# Altium schematic sheet EE194_YESDIG_PCB.SchDoc
size A2
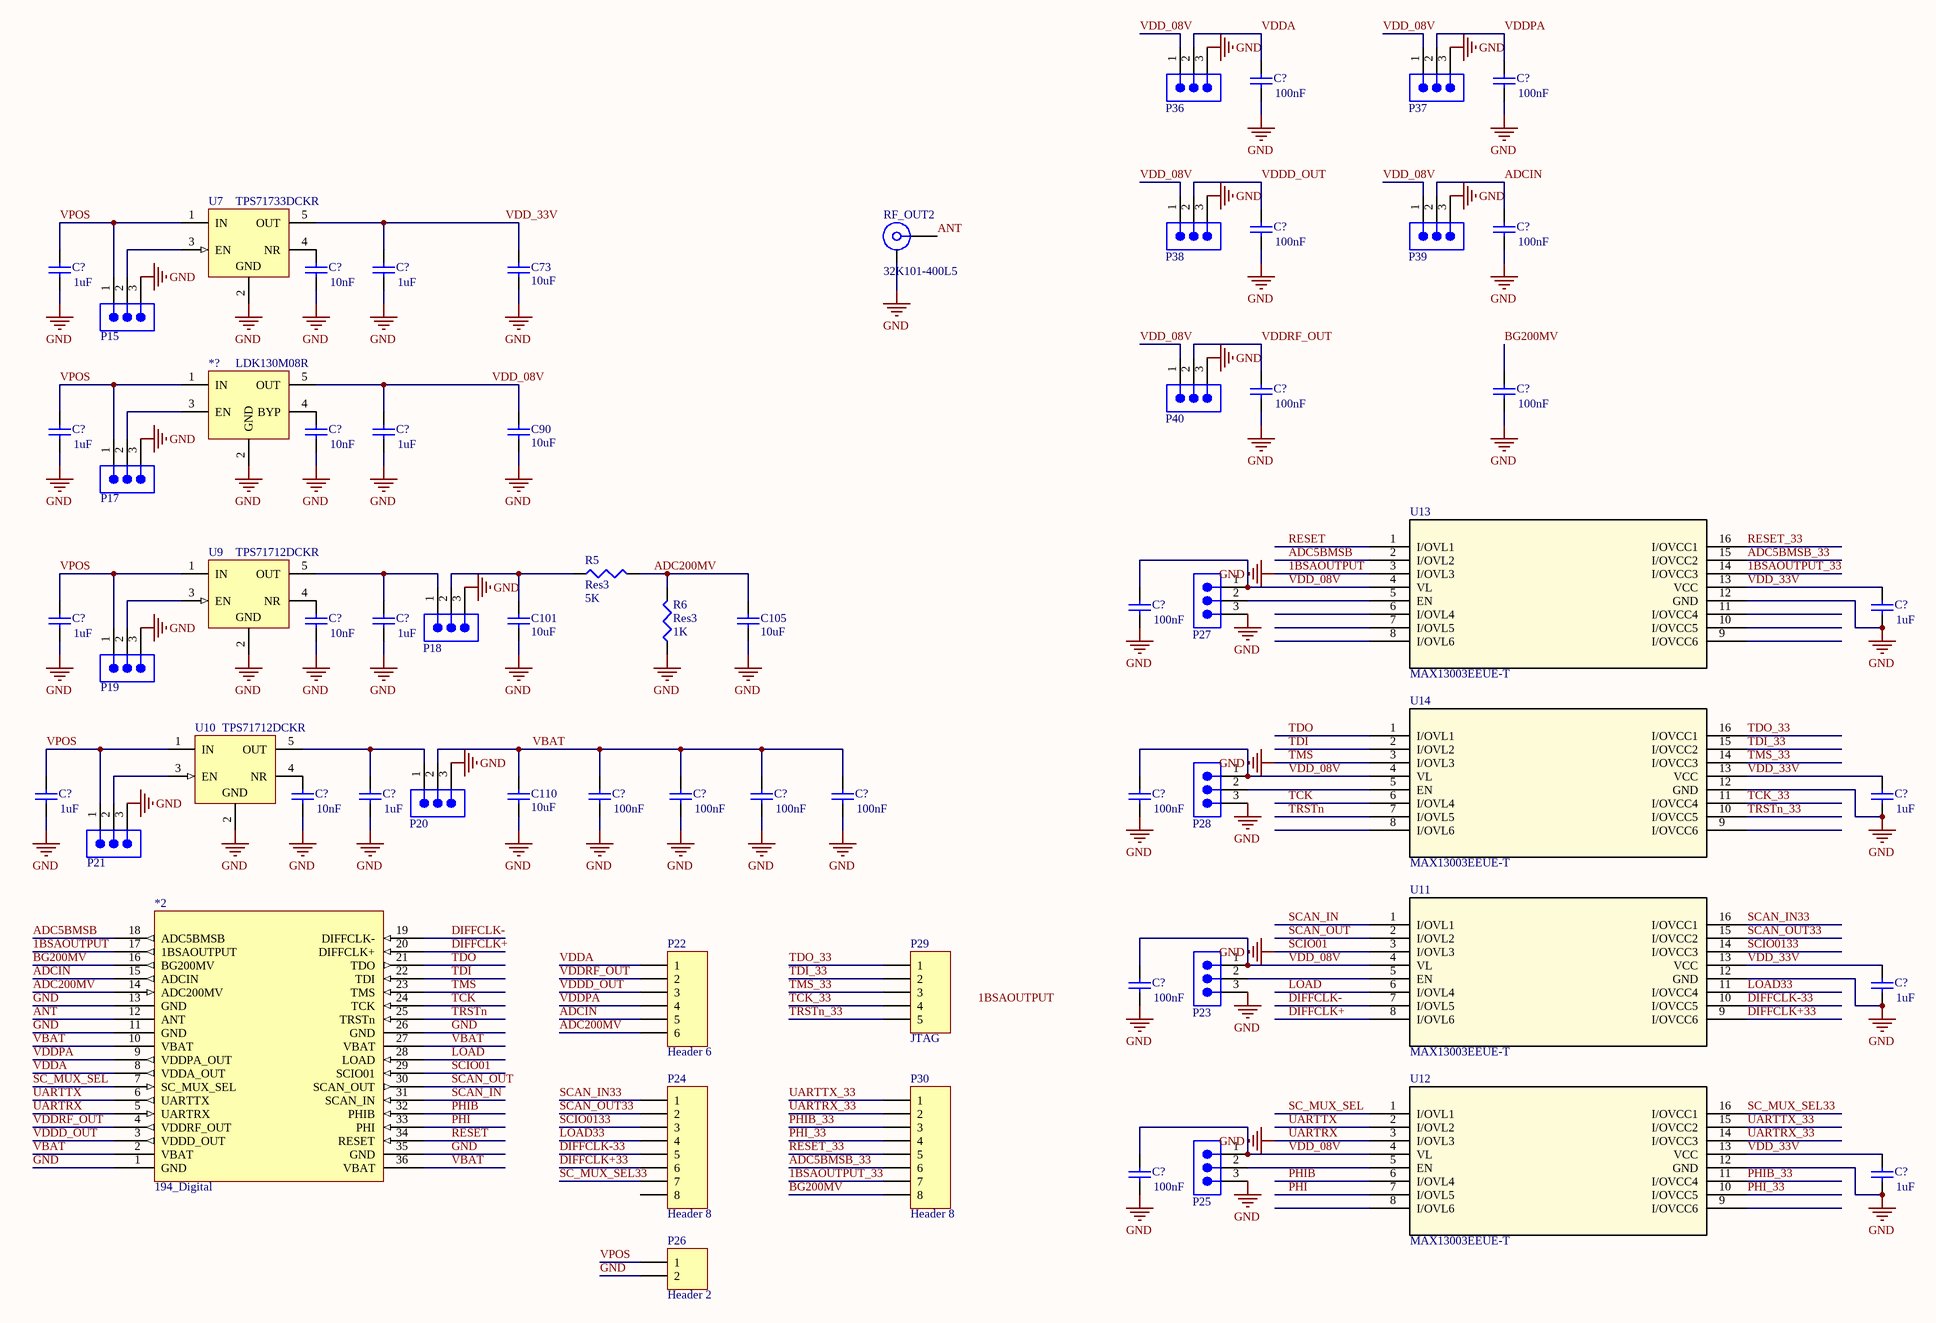
[diagram p0: EE194_YESDIG_PCB.SchDoc]

## Parts
(Parts that share a designator on the sheet are numbered #1, #2 ... from top to bottom, then left to right.)
*2  194_Digital  [EE194_Analog_Chip]
*?  LDK130M08R  [SOT95P290X145-5N]
C73  value 10uF  [CAPC0805(2012)145_N]  (hidden comment: CAP 10uF 25V 0805(2012))
C90  value 10uF  [CAPC0805(2012)145_N]  (hidden comment: CAP 10uF 25V 0805(2012))
C101  value 10uF  [CAPC0805(2012)145_N]  (hidden comment: CAP 10uF 25V 0805(2012))
C105  value 10uF  [CAPC0805(2012)145_N]  (hidden comment: CAP 10uF 25V 0805(2012))
C110  value 10uF  [CAPC0805(2012)145_N]  (hidden comment: CAP 10uF 25V 0805(2012))
C?#1  value 100nF  [0402]  (hidden comment: Cap Semi)
C?#2  value 100nF  [0402]  (hidden comment: Cap Semi)
C?#3  value 100nF  [0402]  (hidden comment: Cap Semi)
C?#4  value 100nF  [0402]  (hidden comment: Cap Semi)
C?#5  value 1uF  [6-0805_N]  (hidden comment: Cap Semi)
C?#6  value 10nF  [6-0805_N]  (hidden comment: Cap Semi)
C?#7  value 1uF  [6-0805_N]  (hidden comment: Cap Semi)
C?#8  value 100nF  [0402]  (hidden comment: Cap Semi)
C?#9  value 100nF  [0402]  (hidden comment: Cap Semi)
C?#10  value 1uF  [6-0805_N]  (hidden comment: Cap Semi)
C?#11  value 10nF  [6-0805_N]  (hidden comment: Cap Semi)
C?#12  value 1uF  [6-0805_N]  (hidden comment: Cap Semi)
C?#13  value 100nF  [0402]  (hidden comment: Cap Semi)
C?#14  value 1uF  [0402]  (hidden comment: Cap Semi)
C?#15  value 1uF  [6-0805_N]  (hidden comment: Cap Semi)
C?#16  value 10nF  [6-0805_N]  (hidden comment: Cap Semi)
C?#17  value 1uF  [6-0805_N]  (hidden comment: Cap Semi)
C?#18  value 1uF  [6-0805_N]  (hidden comment: Cap Semi)
C?#19  value 10nF  [6-0805_N]  (hidden comment: Cap Semi)
C?#20  value 1uF  [6-0805_N]  (hidden comment: Cap Semi)
C?#21  value 100nF  [0402]  (hidden comment: Cap Semi)
C?#22  value 100nF  [0402]  (hidden comment: Cap Semi)
C?#23  value 100nF  [0402]  (hidden comment: Cap Semi)
C?#24  value 100nF  [0402]  (hidden comment: Cap Semi)
C?#25  value 100nF  [0402]  (hidden comment: Cap Semi)
C?#26  value 1uF  [0402]  (hidden comment: Cap Semi)
C?#27  value 100nF  [0402]  (hidden comment: Cap Semi)
C?#28  value 1uF  [0402]  (hidden comment: Cap Semi)
C?#29  value 100nF  [0402]  (hidden comment: Cap Semi)
C?#30  value 1uF  [0402]  (hidden comment: Cap Semi)
P15  TSW-103-07-F-S  [SMTC-TSW-103-07-X-S]  (value not drawn)
P17  TSW-103-07-F-S  [SMTC-TSW-103-07-X-S]  (value not drawn)
P18  TSW-103-07-F-S  [SMTC-TSW-103-07-X-S]  (value not drawn)
P19  TSW-103-07-F-S  [SMTC-TSW-103-07-X-S]  (value not drawn)
P20  TSW-103-07-F-S  [SMTC-TSW-103-07-X-S]  (value not drawn)
P21  TSW-103-07-F-S  [SMTC-TSW-103-07-X-S]  (value not drawn)
P22  Header 6  [HDR1X6]
P23  TSW-103-07-F-S  [SMTC-TSW-103-07-X-S]  (value not drawn)
P24  Header 8  [HDR1X8]
P25  TSW-103-07-F-S  [SMTC-TSW-103-07-X-S]  (value not drawn)
P26  Header 2  [HDR1X2]
P27  TSW-103-07-F-S  [SMTC-TSW-103-07-X-S]  (value not drawn)
P28  TSW-103-07-F-S  [SMTC-TSW-103-07-X-S]  (value not drawn)
P29  JTAG  [HDR1X5]
P30  Header 8  [HDR1X8]
P36  TSW-103-07-F-S  [SMTC-TSW-103-07-X-S]  (value not drawn)
P37  TSW-103-07-F-S  [SMTC-TSW-103-07-X-S]  (value not drawn)
P38  TSW-103-07-F-S  [SMTC-TSW-103-07-X-S]  (value not drawn)
P39  TSW-103-07-F-S  [SMTC-TSW-103-07-X-S]  (value not drawn)
P40  TSW-103-07-F-S  [SMTC-TSW-103-07-X-S]  (value not drawn)
R5  Res3  value 5K  [J1-0603]
R6  Res3  value 1K  [J1-0603]
RF_OUT2  32K101-400L5  [ROS-32K101-400L5_V]
U7  TPS71733DCKR  [DCK0005A_L]
U9  TPS71712DCKR  [DCK0005A_L]
U10  TPS71712DCKR  [DCK0005A_L]
U11  MAX13003EEUE-T  [21-0066J_16]
U12  MAX13003EEUE-T  [21-0066J_16]
U13  MAX13003EEUE-T  [21-0066J_16]
U14  MAX13003EEUE-T  [21-0066J_16]

## Nets
1BSAOUTPUT: *2.1(GND) *2.5(UARTRX) *2.11(GND) *2.13(GND) *2.17(1BSAOUTPUT) *2.23(TMS) *2.26(GND) *2.29(SCIO01) *2.35(GND) *?.2(GND) C73.1 C90.1 C101.1 C105.1 C110.1 C?#1.1 C?#2.1 C?#3.1 C?#4.1 C?#5.1 C?#6.1 C?#7.1 C?#8.1 C?#9.1 C?#10.1 C?#11.1 C?#12.1 C?#13.1 C?#14.1 C?#15.1 C?#16.1 C?#17.1 C?#18.1 C?#19.1 C?#20.1 C?#21.1 C?#22.1 C?#23.1 C?#24.1 C?#25.1 C?#26.1 C?#27.1 C?#28.1 C?#29.1 C?#30.1 P15.3 P17.3 P18.3 P19.3 P20.3 P21.3 P23.3 P25.3 P26.2 P27.3 P28.3 P36.3 P37.3 P38.3 P39.3 P40.3 R6.1 RF_OUT2.MH U7.2(GND) U9.2(GND) U10.2(GND) U11.3(I/OVL3) U11.12(GND) U12.3(I/OVL3) U12.12(GND) U13.3(I/OVL3) U13.12(GND) U14.3(I/OVL3) U14.12(GND)  [also labelled GND, SCIO01, TMS, UARTRX]
1BSAOUTPUT_33: P30.7 U13.14(I/OVCC3)
ADC5BMSB: *2.18(ADC5BMSB) U13.2(I/OVL2)
ADC5BMSB_33: P30.6 U13.15(I/OVCC2)
ADC200MV: *2.14(ADC200MV) C105.2 P22.6 R5.2 R6.2
ADCIN: *2.15(ADCIN) C?#4.2 P22.5 P39.2
ANT: *2.12(ANT) RF_OUT2.1
BG200MV: *2.16(BG200MV) C?#9.2 P30.8
DIFFCLK+: *2.20(DIFFCLK+) U11.8(I/OVL6)
DIFFCLK+33: P24.6 U11.9(I/OVCC6)
DIFFCLK-: *2.19(DIFFCLK-) U11.7(I/OVL5)
DIFFCLK-33: P24.5 U11.10(I/OVCC5)
LOAD: *2.28(LOAD) U11.6(I/OVL4)
LOAD33: P24.4 U11.11(I/OVCC4)
PHI: *2.33(PHI) U12.7(I/OVL5)
PHI_33: P30.4 U12.10(I/OVCC5)
PHIB: *2.32(PHIB) U12.6(I/OVL4)
PHIB_33: P30.3 U12.11(I/OVCC4)
RESET: *2.34(RESET) U13.1(I/OVL1)
RESET_33: P30.5 U13.16(I/OVCC1)
SC_MUX_SEL: *2.7(SC_MUX_SEL) U12.1(I/OVL1)
SC_MUX_SEL33: P24.7 U12.16(I/OVCC1)
SCAN_IN: *2.31(SCAN_IN) U11.1(I/OVL1)
SCAN_IN33: P24.1 U11.16(I/OVCC1)
SCAN_OUT: *2.30(SCAN_OUT) U11.2(I/OVL2)
SCAN_OUT33: P24.2 U11.15(I/OVCC2)
SCIO0133: P24.3 U11.14(I/OVCC3)
TCK: *2.24(TCK) U14.6(I/OVL4)
TCK_33: P29.4 U14.11(I/OVCC4)
TDI: *2.22(TDI) U14.2(I/OVL2)
TDI_33: P29.2 U14.15(I/OVCC2)
TDO: *2.21(TDO) U14.1(I/OVL1)
TDO_33: P29.1 U14.16(I/OVCC1)
TMS_33: P29.3 U14.14(I/OVCC3)
TRSTn: *2.25(TRSTn) U14.7(I/OVL5)
TRSTn_33: P29.5 U14.10(I/OVCC5)
UARTRX_33: P30.2 U12.14(I/OVCC3)
UARTTX: *2.6(UARTTX) U12.2(I/OVL2)
UARTTX_33: P30.1 U12.15(I/OVCC2)
VBAT: *2.2(VBAT) *2.10(VBAT) *2.27(VBAT) *2.36(VBAT) C110.2 C?#21.2 C?#22.2 C?#23.2 C?#24.2 P20.2
VDD_08V: *?.5(OUT) C90.2 C?#12.2 C?#13.2 C?#25.2 C?#27.2 C?#29.2 P23.1 P25.1 P27.1 P28.1 P36.1 P37.1 P38.1 P39.1 P40.1 U11.4(VL) U12.4(VL) U13.4(VL) U14.4(VL)
VDD_33V: C73.2 C?#7.2 C?#14.2 C?#26.2 C?#28.2 C?#30.2 U7.5(OUT) U11.13(VCC) U12.13(VCC) U13.13(VCC) U14.13(VCC)
VDDA: *2.8(VDDA_OUT) C?#1.2 P22.1 P36.2
VDDD_OUT: *2.3(VDDD_OUT) C?#3.2 P22.3 P38.2
VDDPA: *2.9(VDDPA_OUT) C?#2.2 P22.4 P37.2
VDDRF_OUT: *2.4(VDDRF_OUT) C?#8.2 P22.2 P40.2
VPOS: *?.1(IN) C?#5.2 C?#10.2 C?#15.2 C?#18.2 P15.1 P17.1 P19.1 P21.1 P26.1 U7.1(IN) U9.1(IN) U10.1(IN)
Net*?_3: *?.3(EN) P17.2
Net*?_4: *?.4(BYP) C?#11.2
NetC101_2: C101.2 P18.2 R5.1
NetC?#6_2: C?#6.2 U7.4(NR)
NetC?#16_2: C?#16.2 U9.4(NR)
NetC?#17_2: C?#17.2 P18.1 U9.5(OUT)
NetC?#19_2: C?#19.2 U10.4(NR)
NetC?#20_2: C?#20.2 P20.1 U10.5(OUT)
NetP15_2: P15.2 U7.3(EN)
NetP19_2: P19.2 U9.3(EN)
NetP21_2: P21.2 U10.3(EN)
NetP23_2: P23.2 U11.5(EN)
NetP25_2: P25.2 U12.5(EN)
NetP27_2: P27.2 U13.5(EN)
NetP28_2: P28.2 U14.5(EN)

Not connected (* = marked no-connect by the designer): P24 8; U12 8(I/OVL6) 9(I/OVCC6); U13 6(I/OVL4) 7(I/OVL5) 8(I/OVL6) 9(I/OVCC6) 10(I/OVCC5) 11(I/OVCC4); U14 8(I/OVL6) 9(I/OVCC6)

## Notes on the sheet
- Labels drawn without touching a wire or pin: 1BSAOUTPUT

## Library data of the parts
*? = LDK130M08R: 300 mA low quiescent current very low noise LDO (800mV)
C73 C90 C101 C105 C110 = CMP-1036-04932-1: CAP 10uF 25V ±10% 0805 (2012 Metric) Thickness 1.45mm SMD; Case-EIA: 0805; Case-Metric: 2012; Tolerance: Â±10%; Technology: SMT; Rated Voltage: 25 V; Max Thickness: 1.45 mm
C?#1-C?#30 = Cap Semi: Capacitor (Semiconductor SIM Model); Published: 8-Jun-2000; LatestRevisionDate: 29-May-2009; LatestRevisionNote: IPC-7351 Footprint Added.; PackageReference: C1206; Publisher: Altium Limited; PackageDescription: Chip Capacitor
P15 P17-P21 P23 P25 P27 P28 P36-P40 = CMP-1024-00331-1: 0.025" SQ Post Header, Through-hole, Vertical, -55 to 125 degC, 2.54 mm Pitch, 3-Pin, Male, RoHS; Manufacturer: Samtec; Pitch: 2.54 mm; DatasheetVersion: F-214; ComponentLink1Description: Manufacturer URL; ComponentLink3URL: http://www.samtec.com/documents/webfiles/cpdf/TSW-XXX-XX-XXX-X-XX-XXX-MKT.pdf; Mounting Technology: Through-hole; PackageDescription: .025[0.64] SQ. Post Terminal Strip Assembly; Temperature Range: -55 to 125 degC; ComponentLink3Description: Package Specification; Orientation: Vertical; PartNumber: TSW-103-07-F-S; RoHS: True; PackageVersion: DM, 8/1988; ComponentLink2Description: Datasheet; ComponentLink1URL: http://www.samtec.com; ComponentLink2URL: http://www.samtec.com/documents/webfiles/pdf/TSW_TH.PDF; PackageReference: TSW-103-07-X-S
P22 = Header 6: Header, 6-Pin; LatestRevisionDate: 17-Jul-2002; LatestRevisionNote: Re-released for DXP Platform.; Publisher: Altium Limited
P24 P30 = Header 8: Header, 8-Pin; LatestRevisionDate: 17-Jul-2002; LatestRevisionNote: Re-released for DXP Platform.; Publisher: Altium Limited
P26 = Header 2: Header, 2-Pin; LatestRevisionDate: 17-Jul-2002; LatestRevisionNote: Re-released for DXP Platform.; Publisher: Altium Limited
P29 = Header 5: Header, 5-Pin; LatestRevisionDate: 17-Jul-2002; LatestRevisionNote: Re-released for DXP Platform.; Publisher: Altium Limited
R5 R6 = Res3: Resistor; Published: 8-Jun-2000; LatestRevisionDate: 29-May-2009; LatestRevisionNote: IPC-7351 Footprint Added.; PackageReference: J1-0603; Publisher: Altium Limited; PackageDescription: Chip Resistor
RF_OUT2 = CMP-0751-00001-1: SMA Straight Jack, Up to 18 GHz, -55 to 155 degC; Manufacturer: Rosenberger; Design Note: Footprint in library is a generic example - only application specific footprint delivers High Performance; PartNumber: 32K101-400L5; PackageDescription: SMA Straight Jack, 6.35 x 6.35 x 9.5 mm; ComponentLink5URL: http://www.rosenberger.com/en/contact/sales/; DatasheetVersion: a00; ComponentLink3URL: http://rosenberger.de/ok/images/documents/db/32K101-400L5.pdf; ComponentLink4Description: Series Overview / Design Note; ComponentLink5Description: Webshop / RFQ; PackageReference: 32K101-400L5; ComponentLink2Description: Datasheet; PackageVersion: a00; ComponentLink1Description: Manufacturer URL; ComponentLink3Description: Package Specification; ComponentLink2URL: http://rosenberger.de/ok/images/documents/db/32K101-400L5.pdf; Mounting Technology: Through Hole; ComponentLink1URL: http://www.rosenberger.de; ComponentLink4URL: http://rosenberger.de/ok/images/documents/spez/32.pdf
U7 = CMP-0394-00837-2: Single Output High PSRR LDO, 150 mA, Fixed 1.2 V Output, 2.5 to 6.5 V Input, 5-pin SC70 (DCK), -40 to 125 degC, Green (RoHS & no Sb/Br); PartNumber: TPS71712DCKR; Manufacturer: Texas Instruments; Accuracy(%): 3; Fixed Output Options(V): 1.2; Vin(Min)(V): 2.5; SubFamily: Single Channel LDO; Vin(Max)(V): 6.5; Iout(Max)(A): 0.15; Iq(Typ)(mA): 0.05; Vdo(Typ)(mV): 170; DatasheetVersion: SBVS068G; PackageReference: DCK0005A; ComponentLink3Description: Package Specification; Eco-Plan: Green (RoHS & no Sb/Br); ComponentLink2Description: Datasheet; PackageDescription: 5-Pin Plastic Small-Outline, Body 2 x 1.25 mm, Pitch 0.65 mm; ComponentLink1URL: http://www.ti.com/; ComponentLink1Description: Manufacturer URL; PackageVersion: 4093553-3/G; Vout Adj(Min)(V): 1.2; ComponentLink2URL: http://www.ti.com/general/docs/lit/getliterature.tsp?genericPartNumber=TPS71712&fileType=pdf; Vout Adj(Max)(V): 1.2; ComponentLink3URL: http://www.ti.com/litv/pdf/mpds025f; Mounting Technology: Surface Mount; Code_JEDEC: MO-203
U9 U10 = CMP-0394-00837-2: Single Output High PSRR LDO, 150 mA, Fixed 1.2 V Output, 2.5 to 6.5 V Input, 5-pin SC70 (DCK), -40 to 125 degC, Green (RoHS & no Sb/Br); Manufacturer: Texas Instruments; Accuracy(%): 3; Fixed Output Options(V): 1.2; Vin(Min)(V): 2.5; SubFamily: Single Channel LDO; Vin(Max)(V): 6.5; Iout(Max)(A): 0.15; Iq(Typ)(mA): 0.05; Vdo(Typ)(mV): 170; DatasheetVersion: SBVS068G; PackageReference: DCK0005A; PartNumber: TPS71712DCKR; ComponentLink3Description: Package Specification; Eco-Plan: Green (RoHS & no Sb/Br); ComponentLink2Description: Datasheet; PackageDescription: 5-Pin Plastic Small-Outline, Body 2 x 1.25 mm, Pitch 0.65 mm; ComponentLink1URL: http://www.ti.com/; ComponentLink1Description: Manufacturer URL; PackageVersion: 4093553-3/G; Vout Adj(Min)(V): 1.2; ComponentLink2URL: http://www.ti.com/general/docs/lit/getliterature.tsp?genericPartNumber=TPS71712&fileType=pdf; Vout Adj(Max)(V): 1.2; ComponentLink3URL: http://www.ti.com/litv/pdf/mpds025f; Mounting Technology: Surface Mount; Code_JEDEC: MO-203
U11-U14 = MAX13003EEUE-T: Imported; Vendor: Maxim; Manufacturer_Part_Number: MAX13003EEUE-T; Manufacturer_Name: Maxim; RefDes: RefDes; Type: Type; Value: Value